# EAGLE design LED_drv (EAGLE 7.6.0)
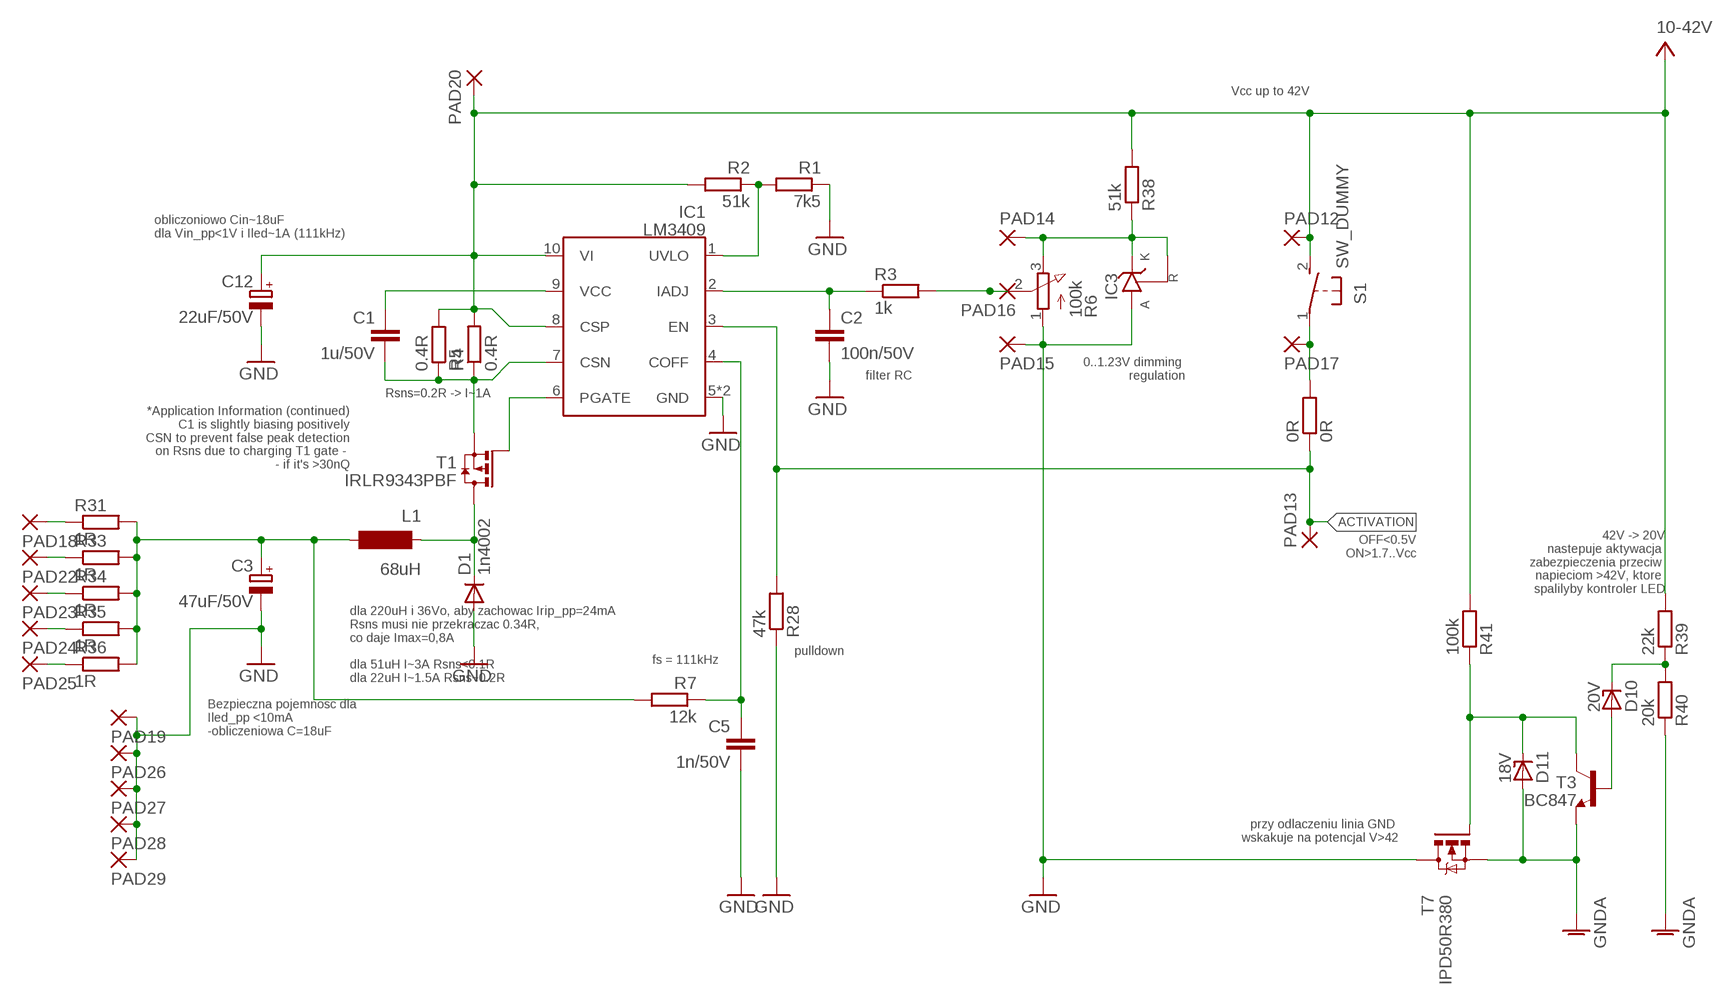
[diagram p0: schematic, sheet 1, part 1 of 2]
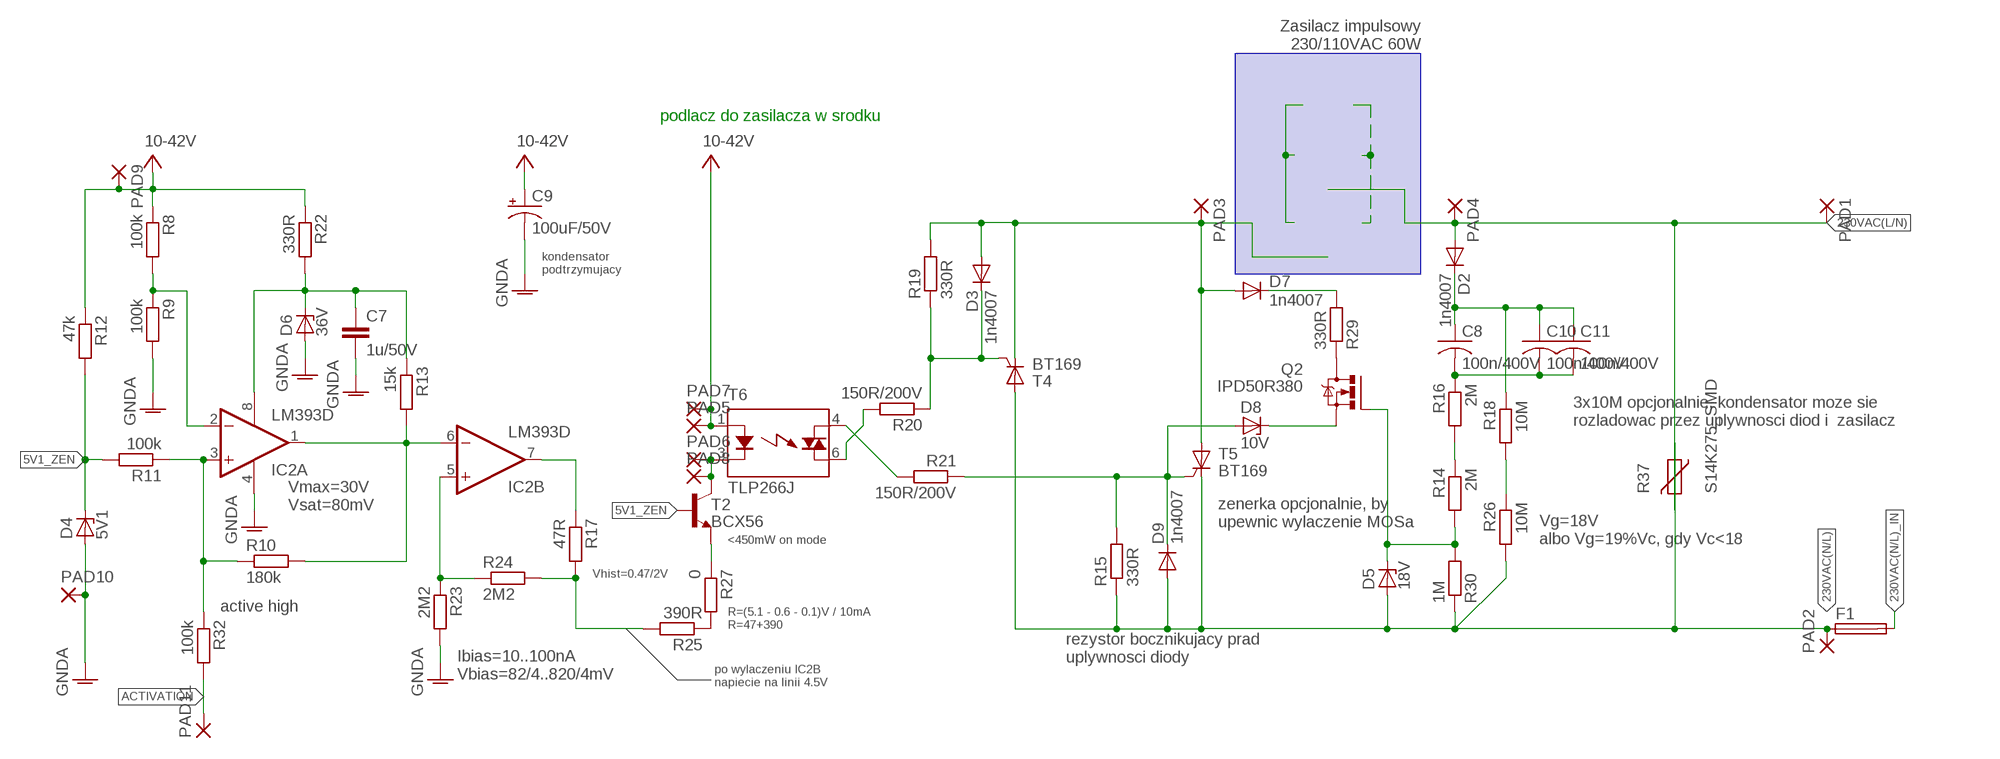
[diagram p1: schematic, sheet 1, part 2 of 2]

## Parts
0R  0R  R-EU_R1206  [R1206]
C1  1u/50V  C-EUC1206  [C1206]
C2  100n/50V  C-EUC0805  [C0805]
C3  47uF/50V  CPOL-EUE5-6  [E5-6]
C5  1n/50V  C-EUC0603  [C0603]
C7  1u/50V  C-EUC1206  [C1206]
C8  100n/400V  C-US075-032X103  [C075-032X103]
C9  100uF/50V  CPOL-USE3.5-8  [E3,5-8]
C10  100n/400V  C-US075-032X103  [C075-032X103]
C11  100n/400V  C-US075-032X103  [C075-032X103]
C12  22uF/50V  CPOL-EUE5-6  [E5-6]
D1  1n4002  DIODE-DO214AC  [DO214AC]
D2  1n4007  DIODE-DO-214AC  [DO-214AC]
D3  1n4007  DIODE-DO-214AC  [DO-214AC]
D4  5V1  ZENER-DIODESOD80C  [SOD80C]
D5  18V  ZENER-DIODESOD80C  [SOD80C]
D6  36V  ZENER-DIODESOD80C  [SOD80C]
D7  1n4007  DIODE-DO-214AC  [DO-214AC]
D8  10V  ZENER-DIODESOD80C  [SOD80C]
D9  1n4007  DIODE-DO-214AC  [DO-214AC]
D10  20V  ZENER-DIODESOD80C  [SOD80C]
D11  18V  ZENER-DIODESOD80C  [SOD80C]
F1  SH22,5A  [SH22,5A]
IC1  LM3409  [HVSSOP-10]
IC2  LM393D  [SO08]
IC3  TL431-ASA  [SOT23-3]
L1  68uH  CDRH104R  [CDRH104-R]
PAD1  SMD5  [SMD2,54-5,08]
PAD2  SMD5  [SMD2,54-5,08]
PAD3  SMD5  [SMD2,54-5,08]
PAD4  SMD5  [SMD2,54-5,08]
PAD5  SMD2  [SMD1,27-2,54]
PAD6  SMD2  [SMD1,27-2,54]
PAD7  SMD2  [SMD1,27-2,54]
PAD8  SMD2  [SMD1,27-2,54]
PAD9  SMD2  [SMD1,27-2,54]
PAD10  SMD2  [SMD1,27-2,54]
PAD11  SMD2  [SMD1,27-2,54]
PAD12  SMD2  [SMD1,27-2,54]
PAD13  SMD2  [SMD1,27-2,54]
PAD14  SMD2  [SMD1,27-2,54]
PAD15  SMD2  [SMD1,27-2,54]
PAD16  SMD2  [SMD1,27-2,54]
PAD17  SMD2  [SMD1,27-2,54]
PAD18  SMD2  [SMD1,27-2,54]
PAD19  SMD2  [SMD1,27-2,54]
PAD20  SMD2  [SMD1,27-2,54]
PAD22  SMD2  [SMD1,27-2,54]
PAD23  SMD2  [SMD1,27-2,54]
PAD24  SMD2  [SMD1,27-2,54]
PAD25  SMD2  [SMD1,27-2,54]
PAD26  SMD2  [SMD1,27-2,54]
PAD27  SMD2  [SMD1,27-2,54]
PAD28  SMD2  [SMD1,27-2,54]
PAD29  SMD2  [SMD1,27-2,54]
Q2  IPD50R380  [TO252-3-11]
R1  7k5  R-EU_R1206  [R1206]
R2  51k  R-EU_R1206  [R1206]
R3  1k  R-EU_R0805  [R0805]
R4  0.4R  R-EU_R1206  [R1206]
R5  0.4R  R-EU_R1206  [R1206]
R6  100k  3RP/1610N  [3RP/1610N]
R7  12k  R-EU_R1206  [R1206]
R8  100k  R-EU_R0805  [R0805]
R9  100k  R-EU_R1206  [R1206]
R10  180k  R-EU_R1206  [R1206]
R11  100k  R-EU_R0805  [R0805]
R12  47k  R-EU_R0805  [R0805]
R13  15k  R-EU_R0805  [R0805]
R14  2M  R-EU_R1206  [R1206]
R15  330R  R-EU_R1206  [R1206]
R16  2M  R-EU_R1206  [R1206]
R17  47R  R-EU_R0805  [R0805]
R18  10M  R-EU_R1206  [R1206]
R19  330R  R-EU_R1206  [R1206]
R20  150R/200V  R-EU_R1206  [R1206]
R21  150R/200V  R-EU_R1206  [R1206]
R22  330R  R-EU_R0805  [R0805]
R23  2M2  R-EU_R0805  [R0805]
R24  2M2  R-EU_R0805  [R0805]
R25  390R  R-EU_R0805  [R0805]
R26  10M  R-EU_R1206  [R1206]
R27  0  R-EU_R1206  [R1206]
R28  47k  R-EU_R0805  [R0805]
R29  330R  R-EU_R1206  [R1206]
R30  1M  R-EU_R1206  [R1206]
R31  1R  R-EU_R1206  [R1206]
R32  100k  R-EU_R0805  [R0805]
R33  1R  R-EU_R1206  [R1206]
R34  1R  R-EU_R1206  [R1206]
R35  1R  R-EU_R1206  [R1206]
R36  1R  R-EU_R1206  [R1206]
R37  S14K275_SMD  [S14K275_SMD]
R38  51k  R-EU_R1206  [R1206]
R39  22k  R-EU_R1206  [R1206]
R40  20k  R-EU_R1206  [R1206]
R41  100k  R-EU_R1206  [R1206]
S1  SW_DUMMY  [SW_DUMMY]
T1  IRLR9343PBF  [TO252-3-11]
T2  BCX56  [SOT89]
T3  BC847  [SOT23]
T4  BT169  [SOT223]
T5  BT169  [SOT223]
T6  TLP266J  [SO6]
T7  IPD50R380  [TO252-3-11]

## Nets
5V1_ZEN: D4.C R11.2 R12.2 T2.B
230VAC(L/N): D2.A PAD1.1(P) PAD4.1(P) R37.2
230VAC(N/L): D5.A D9.A F1.1 PAD2.1(P) R15.1 R26.2 R30.1 R37.1 T4.2(A) T4.4(A) T5.3(C)
230VAC(N/L)_IN: F1.2
ACTIVATION: 0R.1 IC1.3(EN) PAD11.1(P) PAD13.1(P) R28.2 R32.2
EER: IC2.3(A:+IN) R10.1 R11.1 R32.1
GND: C2.2 C3.- C5.2 C12.- D1.A IC1.5(GND) IC1.EXT(GND) IC3.3(A) PAD15.1(P) PAD19.1(P) PAD26.1(P) PAD27.1(P) PAD28.1(P) PAD29.1(P) R1.1 R6.1(A) R28.1 T7.2(D)
GNDA: C7.2 C9.- D4.A D6.A D11.A IC2.4(P:V-) PAD10.1(P) R9.2 R23.2 R40.1 T3.2(E) T7.3(S)
N$1: IC1.1(UVLO) R1.2 R2.1
N$2: D11.C R41.1 T3.3(C) T7.1(G)
N$3: C1.1 IC1.9(VCC)
N$4: C1.2 IC1.7(CSN) R4.1 R5.1 T1.2(S)
N$5: C2.1 IC1.2(IADJ) R3.1
N$6: D1.C L1.1 T1.3(D)
N$7: D5.C Q2.1(G) R14.2 R30.2
N$8: PAD16.1(P) R3.2 R6.2(S)
N$9: IC1.6(PGATE) T1.1(G)
N$10: 0R.2 PAD17.1(P) S1.1(P)
N$11: C3.+ L1.2 R7.2 R31.2 R33.2 R34.2 R35.2 R36.2
N$12: R25.1 R27.2
N$13: C5.1 IC1.4(COFF) R7.1
N$14: C8.1 C10.1 C11.1 D2.C R18.1
N$15: R14.1 R16.2
N$16: R21.2 T6.4(DS1)
N$19: IC2.2(A:-IN) R8.2 R9.1
N$20: PAD22.1(P) R33.1
N$21: IC2.5(B:+IN) R23.1 R24.1
N$22: R27.1 T2.E
N$23: D3.C R19.1 R20.1 T4.1(G)
N$24: D7.C R29.2
N$25: R20.2 T6.6(DS2)
N$26: R18.2 R26.1
N$27: PAD6.1(P) PAD8.1(P) T2.C T2.C@1(C) T6.3(K)
N$28: IC2.7(B:OUT) R17.1
N$29: IC2.1(A:OUT) IC2.6(B:-IN) R10.2 R13.2
N$30: R17.2 R24.2 R25.2
N$31: C7.1 D6.C IC2.8(P:V+) R13.1 R22.2
N$32: PAD18.1(P) R31.1
N$33: D8.C Q2.3(S)
N$34: C8.2 C10.2 C11.2 R16.1
N$35: PAD23.1(P) R34.1
N$36: PAD24.1(P) R35.1
N$37: PAD25.1(P) R36.1
N$38: Q2.2(D) R29.1
N$39: D8.A D9.C R15.2 R21.1 T5.1(G)
N$40: D10.C R39.1 R40.2
N$42: D10.A T3.1(B)
N$43: IC3.1(R) IC3.2(K) PAD14.1(P) R6.3(E) R38.1
NAH: D3.A D7.A PAD3.1(P) R19.2 T4.3(C) T5.2(A) T5.4(A)
V+: C9.+ C12.+ IC1.8(CSP) IC1.10(VI) PAD5.1(P) PAD7.1(P) PAD9.1(P) PAD12.1(P) PAD20.1(P) R2.2 R4.2 R5.2 R8.1 R12.1 R22.1 R38.2 R39.2 R41.2 S1.2(S) T6.1(A) ; supply symbol labelled 10-42V

## Notes on the sheet
- Vcc up to 42V
- Zasilacz impulsowy
  230/110VAC 60W
- podlacz do zasilacza w srodku
- obliczoniowo Cin~18uF
  dla Vin_pp<1V i Iled~1A (111kHz)
- filter RC
- 0..1.23V dimming 
  regulation
- kondensator
  podtrzymujacy
- Rsns=0.2R -> I~1A
- *Application Information (continued)
  C1 is slightly biasing positively
  CSN to prevent false peak detection
  on Rsns due to charging T1 gate - 
  - if it's >30nQ
- 3x10M opcjonalnie, kondensator moze sie
  rozladowac przez uplywnosci diod i  zasilacz
- OFF<0.5V
  ON>1.7..Vcc
- 42V -> 20V
  nastepuje aktywacja 
  zabezpieczenia przeciw 
  napieciom >42V, ktore 
  spalilyby kontroler LED
- Vmax=30V
  Vsat=80mV
- pulldown
- zenerka opcjonalnie, by 
  upewnic wylaczenie MOSa
- fs = 111kHz | <450mW on mode
- Vg=18V 
  albo Vg=19%Vc, gdy Vc<18
- dla 220uH i 36Vo, aby zachowac Irip_pp=24mA
  Rsns musi nie przekraczac 0.34R,
  co daje Imax=0,8A
  
  dla 51uH I~3A Rsns<0.1R
  dla 22uH I~1.5A Rsns~0.2R
- Vhist=0.47/2V
- Bezpieczna pojemnosc dla
  Iled_pp <10mA
  -obliczeniowa C=18uF
- active high
- R=(5.1 - 0.6 - 0.1)V / 10mA
  R=47+390
- rezystor bocznikujacy prad 
  uplywnosci diody
- Ibias=10..100nA
  Vbias=82/4..820/4mV
- po wylaczeniu IC2B 
  napiecie na linii 4.5V
- przy odlaczeniu linia GND 
  wskakuje na potencjal V>42

## Library data of the parts
0R R4 R5 R8 R11-R13 R17 R22-R25 R31-R36 = resistor:R-EU_: RESISTOR, European symbol
C1 C2 C5 C7 = rcl:C-EU: CAPACITOR, European symbol
C3 C12 = rcl:CPOL-EU: POLARIZED CAPACITOR, European symbol
C8 C10 C11 = rcl:C-US: CAPACITOR, American symbol
C9 = rcl:CPOL-US: POLARIZED CAPACITOR, American symbol
D1-D3 D7 D9 = diode:DIODE-: DIODE
D4-D6 D8 D10 D11 = diode:ZENER-DIODE: Z-Diode
F1 = fuse:SH22,5A: FUSE HOLDER grid 22,5mm, isolated cap OGN0031 8201, Schurter (Buerklin); MPN: 0031.7701.11; OC_FARNELL: unknown; OC_NEWARK: 04F1224
IC1 = TI:LM3409: Switching buck converter designated for constant current LED driving Vmax=42V
IC2 = linear:LM393: COMPARATOR
IC3 = TI:TL431-ASA: Reference voltage source with ultra low current (100uA) Vref=1.24 typ.
L1 = miscrel:CDRH104R: Shielded POWER inductor SMD for DC-DC converters 1A current
PAD1-PAD4 = wirepad:SMD5: SMD PAD
PAD5-PAD20 PAD22-PAD29 = wirepad:SMD2: SMD PAD
Q2 T7 = miscrel:IPD50R380: N-MOSFET 600V power transistor, low RDSon
R1-R3 R7 R9 R10 R14-R16 R18-R21 R26-R30 R38-R41 = rcl:R-EU_: RESISTOR, European symbol
R6 = pot:3RP/1610N: 16mm Potentiometer one level Source: http://www.alphapotentiometers.net/html/16mm_pot_2.html
R37 = varistor:S14K275_SMD: Custom SMD pad mount for THT varistor
S1 = switch-omron:SW_DUMMY: dummy representation of a simple switch
T1 = miscrel:IRLR9343PBF: Power P-MOS TO252-3 <100mOhm rds-on
T2 = miscrel:BCX56: BCX56 NPN medium power transistor
T3 = transistor:BC847: NPN TRANSISTOR
T4 T5 = miscrel:BT169: Thyristor AC230V 1A logic level
T6 = miscrel:TLP266J: Optotriac IR-LED-1.7V: 400V 200mW

## Board
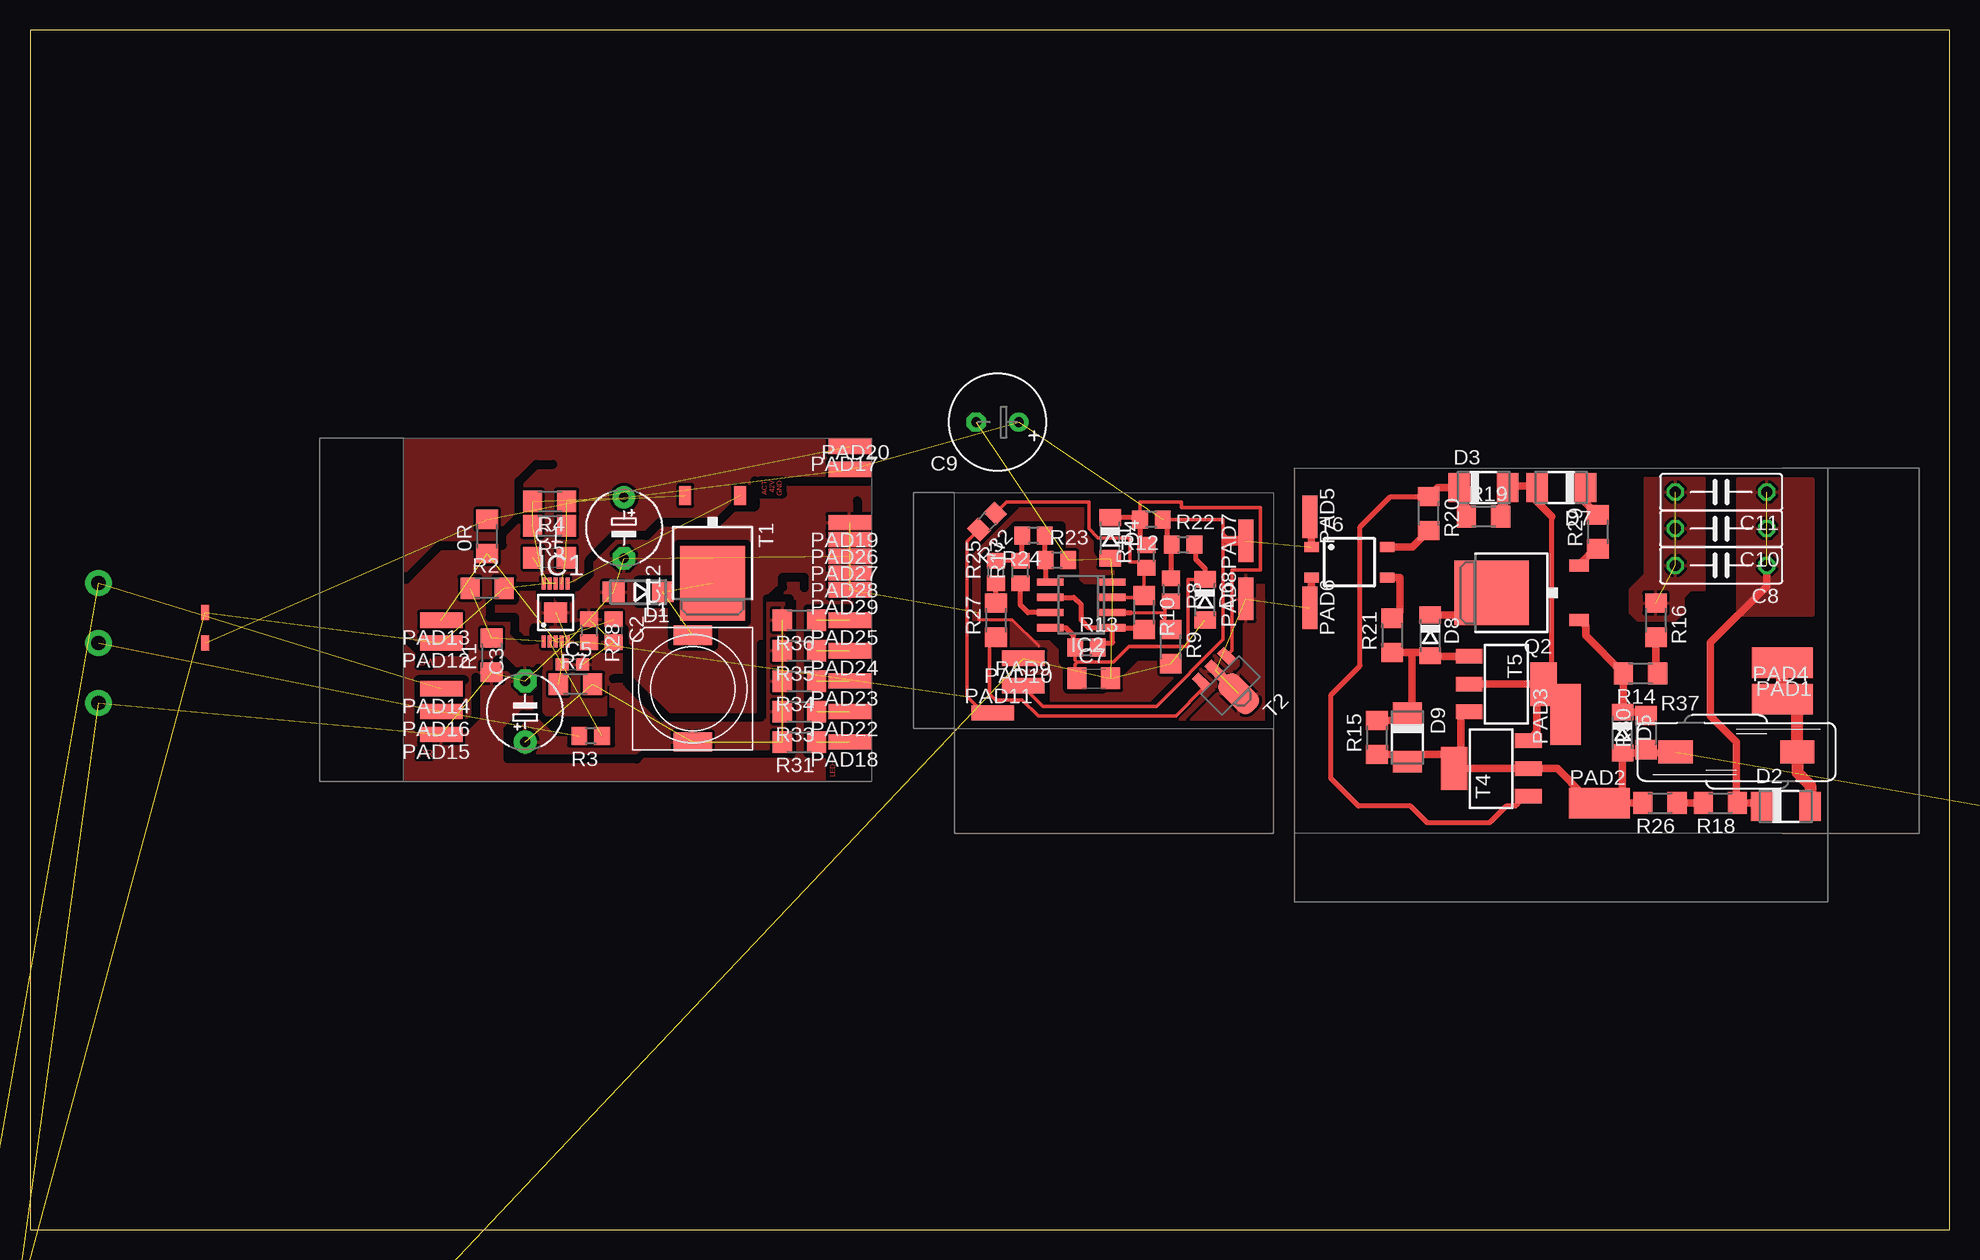
[diagram p2: board, top side]
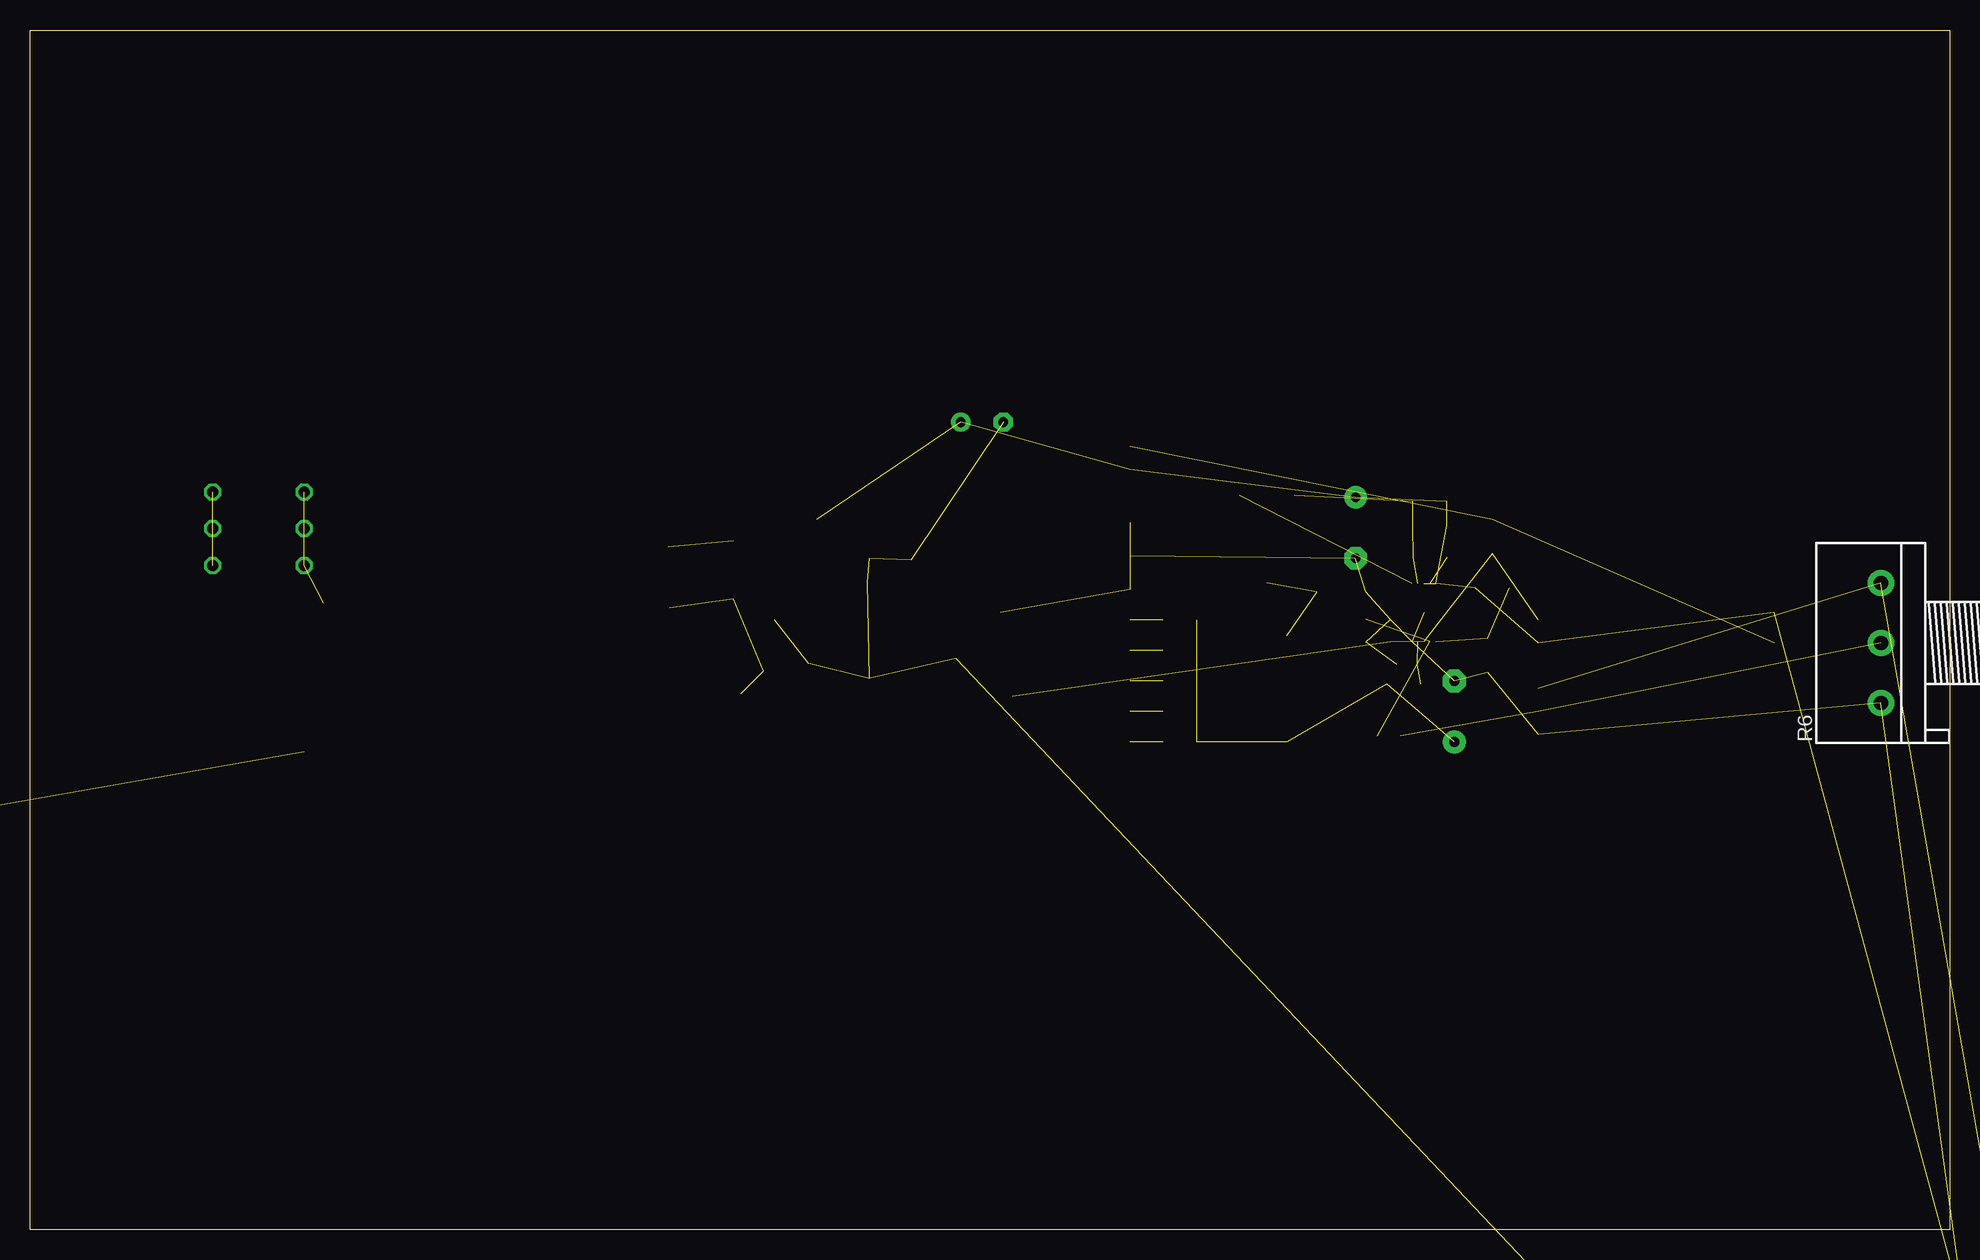
[diagram p3: board, bottom side, seen from below]

Size 160 x 100 mm. Coordinates in mm from the lower left corner, seen from the top.
Outline: 0,0 160,0 160,100 0,100 0,0
Copper layers (1*16): Top 0.035mm / dielectric 1.5mm / Bottom 0.035mm
Design rules "default *": minimum track width 6mil, minimum drill 0.3mm, track to track 6mil, track to pad 6mil, pad to pad 6mil, via to via 6mil, smd to smd 6mil, copper to edge 40mil, drill to drill 8mil, minimum pad ring 10mil, minimum via ring 8mil, stop-mask expansion 4mil, vias tented up to drill 0mil, thermal gap 10mil
tRestrict: area 32.3,39.3 to 33.5,40.1; area 32.3,46.9 to 33.5,47.7; 143 lines

### Footprints (pad centres in the part's own frame; a part is rotated, then mirrored left to right if it is on the bottom)
R1206 = smd 1.6 x 1.803: 1 -1.422,0; 2 1.422,0
C1206 = smd 1.6 x 1.8: 1 -1.4,0; 2 1.4,0
C0805 = smd 1.3 x 1.5: 1 -0.95,0; 2 0.95,0
E5-6 = drill 0.813 pad 1.905: + -2.54,0 | drill 0.813 pad 1.905 octagon: - 2.54,0
C0603 = smd 1.1 x 1: 1 -0.85,0; 2 0.85,0
C075-032X103 = drill 0.914 octagon: 1 -3.81,0; 2 3.81,0
E3,5-8 = drill 0.813 pad 1.6: + -1.778,0 | drill 0.813 pad 1.6 octagon: - 1.778,0
DO214AC = smd 1.8 x 1.7: A 2.05,0; C -2.05,0
DO-214AC = smd 1.8 x 2.4: A 2.025,0; C -2.025,0
SOD80C = smd 1.4 x 1.8: A 1.7,0; C -1.7,0
SH22,5A = drill 1.321 pad 2.54 long: 1 -11.252,0; 2 11.252,0
HVSSOP-10 = smd 0.3 x 1: 1 -1,-2.4; 2 -0.5,-2.4; 3 0,-2.4; 4 0.5,-2.4; 5 1,-2.4; 6 1,2.4; 7 0.5,2.4; 8 0,2.4; 9 -0.5,2.4; 10 -1,2.4 | smd 1.9 x 1.7: EXT 0,0
SO08 = smd 0.6 x 2.2: 1 -1.905,-2.6; 2 -0.635,-2.6; 3 0.635,-2.6; 4 1.905,-2.6; 5 1.905,2.6; 6 0.635,2.6; 7 -0.635,2.6; 8 -1.905,2.6
SOT23-3 = smd 1 x 1.4: 1 -0.95,-1.1; 2 0.95,-1.1; 3 0,1.1
CDRH104-R = smd 3.2 x 1.6: 1 0,4.45; 2 0,-4.45
SMD2,54-5,08 = smd 2.54 x 5.08: 1 0,0
SMD1,27-2,54 = smd 1.27 x 3.54: 1 0,0
TO252-3-11 = smd 1 x 1.6: 1 -2.28,-4.8; 2 2.28,-4.8 | smd 5.4 x 6.2: 3 0,2.5
R0805 = smd 1.3 x 1.5: 1 -0.95,0; 2 0.95,0
3RP/1610N = drill 1.2 pad 2.184: 1 -5,0; 2 0,0; 3 5,0
S14K275_SMD = smd 2.857 x 1.905: 1 -5.08,0; 2 5.08,0
SW_DUMMY = smd 1.27 x 0.635: 1 -1.27,0; 2 1.27,0
SOT89 = smd 0.8 x 1.4: B -1.499,-1.981; E 1.499,-1.981 | smd 0.8 x 1.9: C 0,-1.727 | smd 2.032 x 3.65: C@1 0,0.94
SOT23 = smd 1 x 1.4: 1 -0.95,-1.1; 2 0.95,-1.1; 3 0,1.1
SOT223 = smd 1.219 x 2.235: 1 -2.311,-3.099; 2 0,-3.099; 3 2.311,-3.099 | smd 3.6 x 2.2: 4 0,3.099
SO6 = smd 1.2 x 0.8: 1 -3.15,1.27; 3 -3.15,-1.27; 4 3.15,-1.27; 6 3.15,1.27

### Placement (x,y rotation side)
0R  38.1,57.78 90 top
C1  43.31,56.01 0 top
C2  48.64,49.91 270 top
C3  41.27,43.18 90 top
C5  45.21,47.12 0 top
C7  88.67,45.95 0 top
C8  140.97,55.37 180 top
C9  80.64,67.31 180 top
C10  140.97,58.42 180 top
C11  140.97,61.47 180 top
C12  49.5,58.5 270 top
D1  50.7,53.16 180 top
D2  146.35,35.28 0 top
D3  121.16,61.85 0 top
D4  90.04,57.66 270 top
D5  132.74,41.43 270 top
D6  97.94,52.5 270 top
D7  127.64,61.85 180 top
D8  116.71,49.53 270 top
D9  114.81,41.02 270 top
D10  -5.08,-53.34 0 top  (outside the outline)
D11  -27.94,-74.93 0 top  (outside the outline)
F1  171.45,45.09 90 top  (outside the outline)
IC1  43.81,51.44 0 top
IC2  87.63,52.07 90 top
IC3  -5.08,-35.56 0 top  (outside the outline)
L1  55.24,45.09 0 top
PAD1  146.05,47.24 90 top
PAD2  130.81,35.56 270 top
PAD3  128.02,42.93 0 top
PAD4  146.05,44.2 270 top
PAD5  106.68,59.44 180 top
PAD6  106.68,51.82 180 top
PAD7  101.35,57.4 0 top
PAD8  101.35,52.58 0 top
PAD9  82.8,45.34 270 top
PAD10  82.8,47.62 90 top
PAD11  80.26,43.05 270 top
PAD12  34.29,48.9 90 top
PAD13  34.29,50.8 90 top
PAD14  34.29,45.09 90 top
PAD15  34.29,41.27 90 top
PAD16  34.29,43.18 90 top
PAD17  68.33,65.28 90 top
PAD18  68.33,40.64 90 top
PAD19  68.33,58.93 90 top
PAD20  68.33,63.37 270 top
PAD22  68.33,43.18 90 top
PAD23  68.33,45.72 90 top
PAD24  68.33,48.26 90 top
PAD25  68.33,50.8 90 top
PAD26  68.33,57.53 90 top
PAD27  68.33,56.13 90 top
PAD28  68.33,54.74 90 top
PAD29  68.33,53.34 90 top
Q2  124.33,53.09 90 top
R1  38.48,47.88 90 top
R2  38.1,53.47 0 top
R3  46.74,41.15 180 top
R4  43.31,60.71 180 top
R5  43.31,58.67 180 top
R6  5.71,48.9 90 bottom
R7  45.47,45.47 0 top
R8  95.1,53.34 270 top
R9  95.1,48.59 270 top
R10  92.86,51.44 270 top
R11  93.07,56.11 90 top
R12  93.47,59.18 180 top
R13  88.06,48.54 0 top
R14  134.24,46.35 180 top
R15  112.27,41.02 90 top
R16  135.53,50.8 270 top
R17  82.55,54.81 90 top
R18  140.89,35.56 180 top
R19  121.16,59.44 0 top
R20  116.59,59.69 270 top
R21  113.54,49.53 90 top
R22  96.11,57.1 0 top
R23  85.6,55.8 0 top
R24  83.64,57.86 180 top
R25  80.52,54.81 90 top
R26  135.86,35.56 180 top
R27  80.52,50.8 90 top
R28  46.61,49.91 270 top
R29  130.68,58.17 90 top
R30  134.7,41.43 90 top
R31  64.14,40.64 180 top
R32  79.78,59.03 225 top
R33  64.14,43.18 180 top
R34  64.14,45.72 180 top
R35  64.14,48.26 180 top
R36  64.14,50.8 180 top
R37  142.24,39.83 0 top
R38  -5.08,-15.88 0 top  (outside the outline)
R39  -5.08,-40.64 0 top  (outside the outline)
R40  -5.08,-46.99 0 top  (outside the outline)
R41  -27.94,-68.58 0 top  (outside the outline)
S1  14.61,50.16 90 top
T1  56.9,56.39 180 top
T2  100.08,45.34 225 top
T3  -27.94,-60.96 0 top  (outside the outline)
T4  121.79,38.43 90 top
T5  123.06,45.47 270 top
T6  109.98,55.63 0 top
T7  -25.4,-49.53 0 top  (outside the outline)

### Tracks (layer width: path | path; a pad name or v marks a point on that pad's centre or on a via)
5V1_ZEN
  Top 0.305: R12.2 92.52,60.63 95.96,60.63 95.96,60.17 102.56,60.17 102.56,54.97 100.2,54.97 100.2,48.27 T2.B
  Top 0.406: D4.C 92.52,59.36 R12.2 92.52,57.06 R11.2
230VAC(L/N)
  Top 1.016: 144.02,44.2 PAD4.1 | PAD4.1 PAD1.1 | PAD4.1 147.32,44.2 R37.2 147.32,38.1 148.38,37.04 D2.A
230VAC(N/L)  (1 unrouted)
  Top 0.61: 119.25,39.12 119.25,38.48 T4.4 T4.2 127.31,38.43 129.54,36.2 129.54,36.07 130.43,35.94 PAD2.1 132.74,35.56 | 119.25,39.12 119.25,42.93 119.96,42.93 T5.3 | D9.A 114.2,39.6 | 114.2,39.6 118.77,39.6 119.25,39.12 | 114.2,39.6 R15.1 | 132.74,35.56 D5.A 134.62,39.73 | R26.2 132.74,35.56 | 134.62,39.73 137.06,39.73 R37.1 | R30.1 134.62,40.01 134.62,39.73
ACTIVATION  (4 unrouted)
  Top 0.305: R32.2 78.11,57.35 78.11,44.45 79.5,43.05 PAD11.1
EER
  Top 0.305: R11.1 93.07,55.27 92.71,55.63 91.69,55.63 91.69,57.53 91.57,57.66 89.03,57.66 88.27,58.42 88.27,60.63 81.38,60.63 R32.1 | 93,55.16 R11.1 | IC2.3 92.71,52.7 93.03,52.38 | R11.1 92.86,54.95 R10.1
  Top 0.406: R10.1 92.86,52.7 92.71,52.7
GND  (18 unrouted)
  Top 0.254: 84.09,48.64 81.92,50.8 79.12,50.8 79.12,51.44
  pour Top (isolate 0.254): 77.85,60.96 77.85,42.55 93.34,42.55 99.06,48.26 99.06,54.61 102.87,55.24 102.87,60.96
  pour Top (isolate 0.254): 69.98,45.21 69.98,65.84 31.32,65.84 31.32,37.49 69.98,37.49 69.98,45.19 63.98,45.16 63.98,39.47 39.62,39.5 39.62,41.53 40.77,42.93 48.01,42.93 48.01,45.47 50.67,45.47 52.96,43.18 60.96,43.18 60.96,52.63 63.98,52.6 63.98,45.19
GNDA  (11 unrouted)
N$1  (2 unrouted)
N$2  (3 unrouted)
N$3  (1 unrouted)
N$4  (4 unrouted)
N$5  (2 unrouted)
N$6  (2 unrouted)
N$7
  Top 0.61: Q2.1 129.15,50.81 129.67,50.29 129.67,49.51 R14.2 132.82,43.13 D5.C 134.7,43.13 R30.2
N$8  (2 unrouted)
N$9  (1 unrouted)
N$10  (2 unrouted)
N$11  (7 unrouted)
  pour Top (isolate 0.127): 48.39,42.29 41.53,42.42 40.39,41.27 40.39,39.75 62.87,39.75 62.87,52.2 61.47,52.2 61.47,42.42 52.96,42.42 50.16,45.21 48.39,45.21
N$12
  Top 0.406: R27.2 R25.1
N$13  (2 unrouted)
N$14  (2 unrouted)
  Top 0.61: D2.C 144.33,35.56 R18.1 142.24,35.56 142.24,40.64 140.08,42.8 140.08,48.92 144.78,53.62 C8.1
  pour Top: 142.37,51.18 142.37,62.61 148.59,62.61 148.59,51.18
N$15
  Top 0.61: R14.1 135.53,46.35 R16.2
N$16
  Top 0.61: R21.2 114.17,51.46 114.17,54.36 T6.4
N$19
  Top 0.254: 91.75,51.44 94.61,51.44
  Top 0.305: 94.61,51.91 94.61,51.44 94.61,50.16 94.61,49.53
  Top 0.406: R8.2 94.61,51.91 | IC2.2 91.75,51.44 | R9.1 95.1,50.16 94.61,50.16
N$20  (1 unrouted)
N$21
  Top 0.406: 84.65,58.3 R24.1 84.59,55.86 R23.1 84.65,53.98 IC2.5
N$22
  Top 0.305: 97.61,45.55 97.79,45.38 97.79,45.09 95.5,42.8 84.05,42.8 82.7,44.15 80.47,44.15 79.96,44.65 79.96,49.38 R27.1
  Top 0.406: 80.18,49.9 R27.1 | 97.61,45.55 T2.E
N$23
  Top 0.406: T4.1 124.69,36.17 123.83,35.31 123.06,35.31 121.67,33.91 116.46,33.91 115.06,35.31 110.74,35.31 108.46,37.59 108.46,44.58 110.87,46.99 110.87,58.55 113.41,61.09 116.56,61.09 R20.1
  Top 0.61: R19.1 119.89,59.59 119.89,60.07 119.13,60.83 D3.C 117.37,61.85 R20.1
N$24
  Top 0.61: D7.C 129.53,61.48 129.53,60.74 R29.2
N$25
  Top 0.61: R20.2 115.21,56.9 T6.6
N$26
  Top 0.61: R18.2 R26.1
N$27  (3 unrouted)
  Top 0.61: PAD6.1 106.83,52.22 T6.3
  pour Top: 93.34,42.55 102.87,42.55 102.87,54.61 99.69,54.61 99.69,48.9
N$28
  Top 0.406: IC2.7 83.19,51.44 82.55,52.07 R17.1
N$29
  Top 0.406: IC2.1 88.27,50.16 87.63,50.8 87.63,52.07 87,52.7 IC2.6 | IC2.1 92.75,50.16 R10.2 | R13.2 89.37,48.9 90.17,48.9 90.23,48.95 IC2.1
N$30
  Top 0.406: R25.2 R17.2 82.69,55.91 R24.2
N$31
  Top 0.305: D6.C 96.52,54.2 96.52,48.59 91.59,48.59 90.3,47.3 87.3,47.3 | 87.3,47.3 87.11,47.48 R13.1 | 87.3,47.3 87.12,47.12 87.12,46.69 87.27,46.54 C7.1
  Top 0.406: R13.1 87,48.66 87,49.53 86.36,50.16 IC2.8 | D6.C 97.94,55.09 97.16,55.88 97.16,56.99 97.05,57.09 97.06,57.09 R22.2
N$32  (1 unrouted)
N$33
  Top 0.61: Q2.3 121.4,52.25 120.39,51.23 D8.C
N$34  (3 unrouted)
  pour Top: 134.62,62.61 134.62,54.61 133.35,53.34 133.35,51.44 133.99,50.8 137.16,50.8 137.79,51.44 137.79,52.7 138.43,53.34 139.57,53.34 139.57,62.61
N$35  (1 unrouted)
N$36  (1 unrouted)
N$37  (1 unrouted)
N$38
  Top 0.61: Q2.2 129.13,55.42 130.45,56.74 R29.1
N$39
  Top 0.61: T5.1 117.78,47.78 D8.A 116.44,48.11 115.19,48.11 | 115.19,48.11 R21.1 | R15.2 114.2,42.44 D9.C 115.19,43.43 115.19,48.11
N$40  (2 unrouted)
N$42  (1 unrouted)
N$43  (4 unrouted)
NAH
  Top 0.406: 126.87,46.74 126.87,59.44
  Top 0.61: R19.2 122.58,60.22 123.06,60.71 123.06,61.73 D3.A 123.06,62.49 123.06,61.98 125.61,61.98 D7.A 125.61,60.7 126.87,59.44 | 125.6,45.47 T5.4 126.16,46.02 126.87,46.74 | 125.6,45.47 T5.2 | T4.3 125.6,41.5 125.6,45.47
  Top 1.016: PAD3.1 128.78,44.45 125.73,44.45 125.73,45.47 T5.4
V+  (14 unrouted)
  Top 0.305: R12.1 99.44,59.18 99.44,58.04 | 99.44,56.77 99.44,49.17 93.88,43.61 84.43,43.61 82.8,45.24 PAD9.1 | 99.44,56.77 99.44,58.04 | 99.95,57.53 99.44,58.04 | 99.44,56.77 99.95,57.28
  Top 0.406: R8.1 95.16,54.36 R22.1 94.79,57.47 94.79,58.81 R12.1 | 99.95,57.4 99.95,57.53
  Top 0.61: PAD5.1 106.83,59.03 T6.1
  Top 0.813: PAD7.1 99.95,57.4

### Text on the board
Top: ACT / 42V / GND | SW | PR | LED+